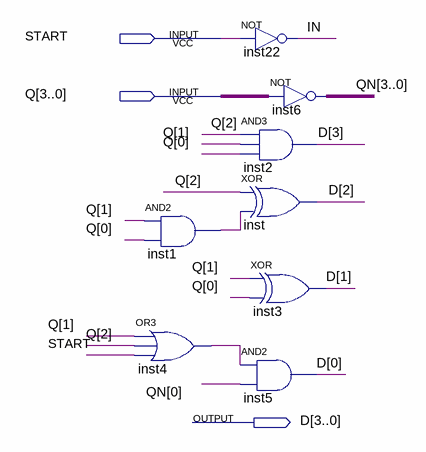
[diagram p0: schematic sheet]
// Quartus schematic NEXTSTATE.bdf as structural Verilog: 8 symbols, 3 pins
module NEXTSTATE (
  input  START,
  input  [3:0] Q,
  output [3:0] D
);

  wire IN, inst1_out, inst4_out;
  wire [3:0] QN;

  and inst1 (inst1_out, Q[1], Q[0]);
  or inst4 (inst4_out, Q[1], Q[2], START);
  not inst22 (IN, START);
  assign QN = ~Q;  // NOT inst6, 4 bits wide
  and inst2 (D[3], Q[2], Q[1], Q[0]);
  xor inst (D[2], Q[2], inst1_out);
  xor inst3 (D[1], Q[1], Q[0]);
  and inst5 (D[0], inst4_out, QN[0]);
endmodule
